# EasyEDA Pro project ProDoc_ChisFlash-MBC5-v1.21_8M.epro

# Schematic ChisFlash-MBC5-v1.21
Board Name: ChisFlash-MBC5-v1.2; Create Date: 2024-10-09; Page Name: P1; Project Name: ChisFlash-MBC5（GBC烧录卡）; Schematic Name: ChisFlash-MBC5-v1.2; Update Date: 2024-11-28; Company: 嘉立创EDA; Page Size: A4; Version: V1.0
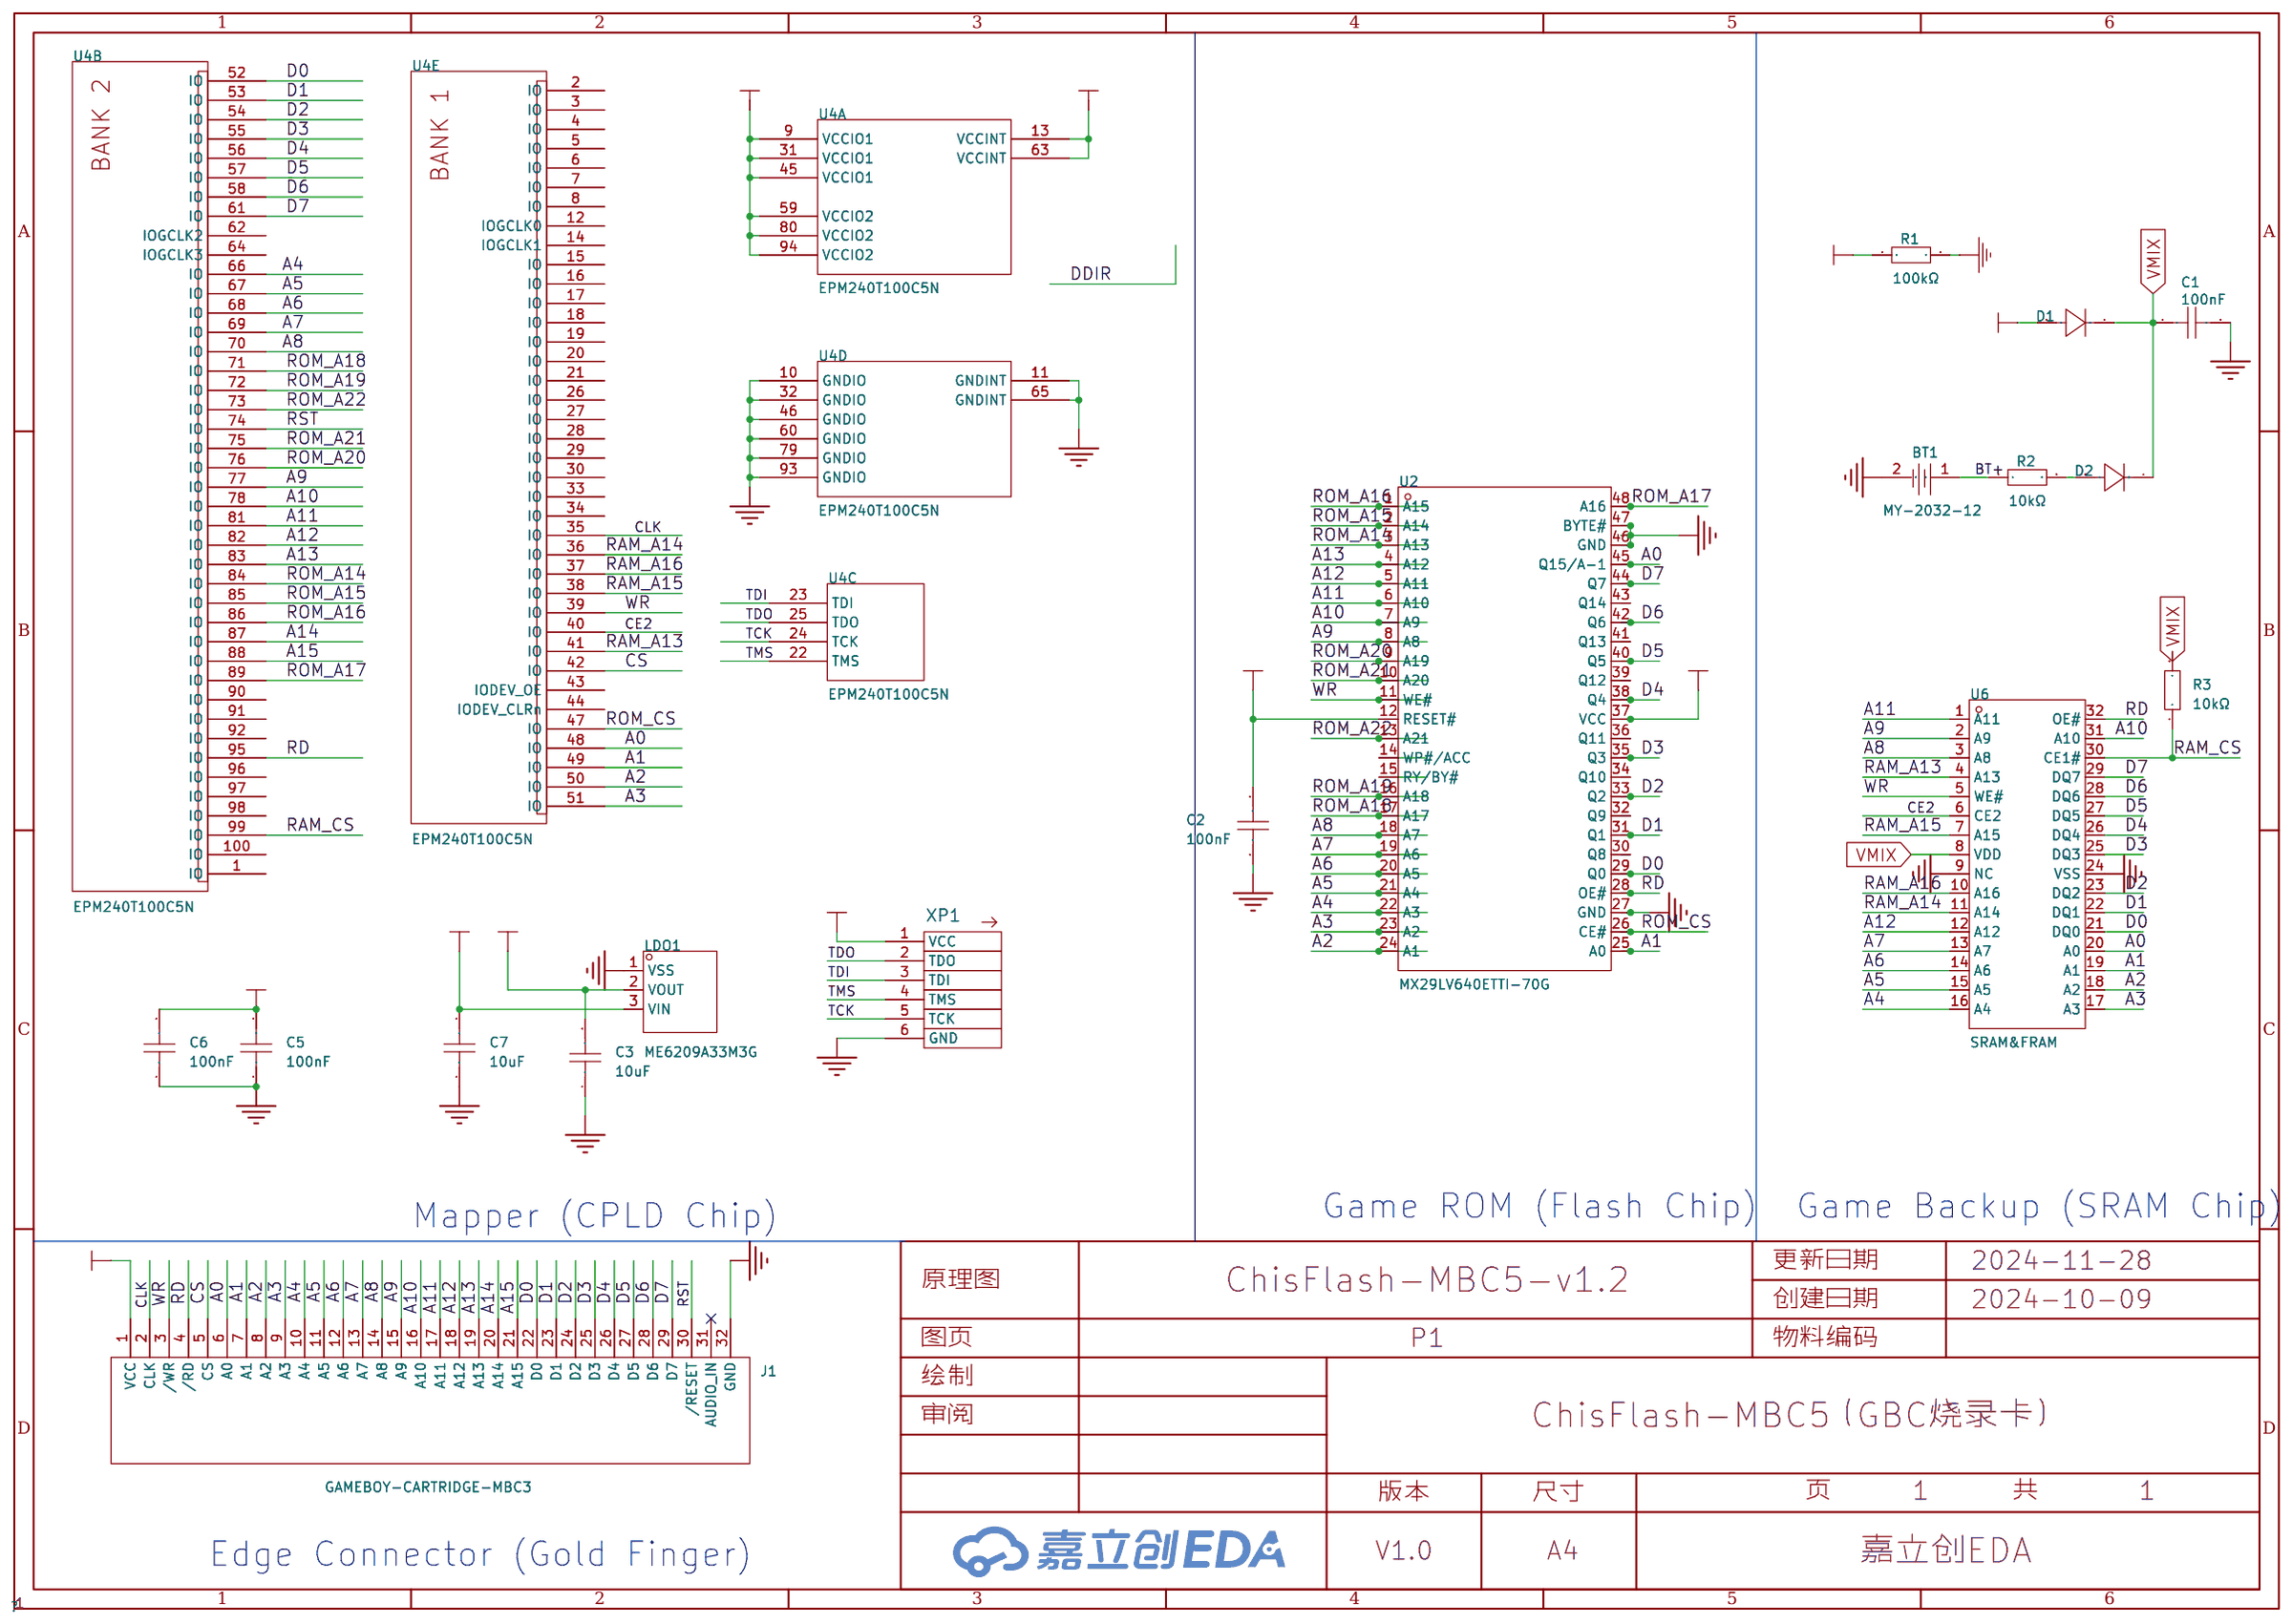
[diagram p0: schematic sheet]

## Parts
BT1  MY-2032-12  [BAT-SMD_MY-2032-12]
C1  100nF  [C0603]
C2  100nF  [C0603]
C3  10uF  [C0603]
C5  100nF  [C0603]
C6  100nF  [C0603]
C7  10uF  [C0603]
D1  1N4148WS  [SOD-323_L1.8-W1.3-LS2.5-RD]
D2  1N4148WS  [SOD-323_L1.8-W1.3-LS2.5-RD]
J1  GAMEBOY-CARTRIDGE-MBC3  [GAMEBOY_CARTRIDGE_PIN]
LDO1  ME6209A33M3G  [SOT-23-3_L2.9-W1.6-P1.90-LS2.8-BR]
R1  100kΩ  [R0603]
R2  10kΩ  [R0603]
R3  10kΩ  [R0603]
U2  MX29LV640ETTI-70G  [TSOP-48_L12.0-W18.4-P0.50-LS20.0-BL]
U4  EPM240T100C5N  [TQFP-100_L14.0-W14.0-P0.50-LS16.0-BL]  (sections 1,2,3,4,5)
U6  SRAM&FRAM  [TSSOP-TSOP二合一]
XP1  JTAG  [HDR-TH_6P-P1.27-V-M-1]  (no BOM)

## Library data of the parts
BT1 = MY-2032-12: LCSC Part Name: CR2032 电池扣; Supplier Part: C964833; Manufacturer: MYOUNG(美阳); Supplier Footprint: SMT; JLCPCB Part Class: Extended Part; Datasheet: https://atta.szlcsc.com/upload/public/pdf/source/20201218/C964833_8D2DD5FC6B310B5B4EFEF4B683694189.pdf; Supplier: LCSC
C1 C2 C5 C6 = CGA0603X7R104K500JT: 容值:100nF;精度:±10%;额定电压:50V;材质(温度系数):X7R;; LCSC Part Name: 100nF ±10% 50V; Supplier Part: C6119867; Manufacturer: HRE(芯声); Supplier Footprint: 0603; JLCPCB Part Class: Extended Part; Supplier: LCSC; Tolerance: ±10%; Voltage Rated: 50V; Temperature Coefficient: X7R
C3 C7 = CL10A106MA8NRNC: 容值:10uF;精度:±20%;额定电压:25V;材质(温度系数):X5R;; LCSC Part Name: 10uF ±20% 25V; Supplier Part: C96446; Manufacturer: SAMSUNG(三星); Supplier Footprint: 0603; JLCPCB Part Class: 基础库; Datasheet: https://atta.szlcsc.com/upload/public/pdf/source/20160218/1457707763339.pdf; Supplier: LCSC; Tolerance: ±20%; Voltage Rated: 25V; Temperature Coefficient: X5R
D1 D2 = 1N4148WS_C917117: 二极管配置:独立式;正向压降(Vf):1.25V@150mA;直流反向耐压(Vr):100V;平均整流电流(Io):300mA;功率:400mW;反向恢复时间(trr):8ns;; LCSC Part Name: 电压:100V 电流:300mA; Supplier Part: C917117; Manufacturer: JSMSEMI(杰盛微); Supplier Footprint: SOD-323; JLCPCB Part Class: Extended Part; Datasheet: https://atta.szlcsc.com/upload/public/pdf/source/20230807/08D9F448A82EA88A23B325A669586A09.pdf; Supplier: LCSC; Diode Configuration: 独立式; Forward Voltage (Vf@If): 1.25V@150mA; Reverse Voltage (Vr): 100V; Average Rectified Current (Io): 300mA; Power Dissipation: 400mW; Reverse Leakage Current: 1uA@75V; Reverse Recovery Time (trr): 8ns; Operating Temperature: -55℃~+150℃@(Tj)
J1 = GAMEBOY-CARTRIDGE-MBC3
LDO1 = ME6209A33M3G: 输出类型:固定;最大输入电压:18V;输出电压:3.3V;最大输出电流:250mA;电源纹波抑制比(PSRR):-;输出极性:正极;; LCSC Part Name: 输入18V 输出3.3V 250mA; Supplier Part: C83508; Manufacturer: MICRONE(南京微盟); Supplier Footprint: SOT-23-3L; JLCPCB Part Class: 扩展库; Datasheet: https://atta.szlcsc.com/upload/public/pdf/source/20161212/1481539101152.pdf; Supplier: LCSC; Output Type: 固定; Maximum Input Voltage: 18V; Output Voltage: 3.3V; MAX Output Current: 250mA; Dropout Voltage: 80mV@(40mA); Output Polarity: 正极; Number of Outputs: 1
R1 = 0603WAF1003T5E: 电阻类型:厚膜电阻;阻值:100kΩ;精度:±1%;功率:100mW;最大工作电压:75V;温度系数:±100ppm/℃;; LCSC Part Name: 100kΩ ±1% 100mW 厚膜电阻; Supplier Part: C25803; Manufacturer: UNI-ROYAL(厚声); Supplier Footprint: 0603; JLCPCB Part Class: Basic Part; Datasheet: https://atta.szlcsc.com/upload/public/pdf/source/20200306/C422600_1E6D84923E4A46A82E41ADD87F860B5C.pdf; Supplier: LCSC; Type: 厚膜电阻; Tolerance: ±1%; Power(Watts): 100mW; Overload Voltage (Max): 75V; Temperature Coefficient: ±100ppm/℃; Operating Temperature Range: -55℃~+155℃; Resistance: 47K
R2 R3 = 0603WAF1002T5E: 电阻类型:厚膜电阻;阻值:10kΩ;精度:±1%;功率:100mW;温度系数:±100ppm/℃;最大工作电压:75V;工作温度范围:-55℃~+155℃;; LCSC Part Name: 10kΩ ±1% 100mW; Supplier Part: C25804; Manufacturer: UNI-ROYAL(厚声); Supplier Footprint: 0603; JLCPCB Part Class: Basic Part; Datasheet: https://atta.szlcsc.com/upload/public/pdf/source/20200306/C422600_1E6D84923E4A46A82E41ADD87F860B5C.pdf; Supplier: LCSC; Type: 厚膜电阻; Tolerance: ±1%; Power(Watts): 100mW; Temperature Coefficient: ±100ppm/℃; Overload Voltage (Max): 75V; Operating Temperature Range: -55℃~+155℃; Resistance: 47K
U2 = MX29LV640ETTI-70G: Supplier Part: C504703; Manufacturer: MXIC(旺宏电子); Supplier Footprint: TSOP-48-18.4mm; JLCPCB Part Class: 扩展库; Datasheet: https://atta.szlcsc.com/upload/public/pdf/source/20140417/1457707044232.pdf; Supplier: LCSC
U4 = EPM240T100C5N: 类型:其它PLD;逻辑门数量:-;逻辑单元数:-;逻辑阵列块数:240;; Supplier Part: C10041; Manufacturer: Intel/Altera; Supplier Footprint: TQFP-100(14x14); JLCPCB Part Class: 扩展库; Datasheet: https://atta.szlcsc.com/upload/public/pdf/source/20121123/1457706563537.pdf; Supplier: LCSC; Type: 其它PLD; Supply Voltage Range - VCCIO: 3.3V；2.5V; Logic Array Blocks: 240; Maximum Delay Time Tpd: 4.7ns; Operating Temperature Range: 0℃~+85℃
U6 = SRAM&FRAM
XP1 = jtag

## Nets
+3V3: C2.2 C3.2 C5.2 C6.2 D1.2(A) LDO1.2(VOUT) R1.1 U2.12(RESET#) U2.37(VCC) U4.9(VCCIO1) U4.13(VCCINT) U4.31(VCCIO1) U4.45(VCCIO1) U4.59(VCCIO2) U4.63(VCCINT) U4.80(VCCIO2) U4.94(VCCIO2) XP1.1(VCC)
+5V: C7.2 J1.1(VCC) LDO1.3(VIN)
GND: BT1.2 C1.2 C2.1 C3.1 C5.1 C6.1 C7.1 J1.32(GND) LDO1.1(VSS) R1.2 U2.27(GND) U2.46(GND) U2.47(BYTE#) U4.10(GNDIO) U4.11(GNDINT) U4.32(GNDIO) U4.46(GNDIO) U4.60(GNDIO) U4.65(GNDINT) U4.79(GNDIO) U4.93(GNDIO) U6.9(NC) U6.24(VSS) XP1.6(GND)
A0: J1.6(A0) U2.45(Q15/A-1) U4.48(IO) U6.20(A0)
A1: J1.7(A1) U2.25(A0) U4.49(IO) U6.19(A1)
A2: J1.8(A2) U2.24(A1) U4.50(IO) U6.18(A2)
A3: J1.9(A3) U2.23(A2) U4.51(IO) U6.17(A3)
A4: J1.10(A4) U2.22(A3) U4.66(IO) U6.16(A4)
A5: J1.11(A5) U2.21(A4) U4.67(IO) U6.15(A5)
A6: J1.12(A6) U2.20(A5) U4.68(IO) U6.14(A6)
A7: J1.13(A7) U2.19(A6) U4.69(IO) U6.13(A7)
A8: J1.14(A8) U2.18(A7) U4.70(IO) U6.3(A8)
A9: J1.15(A9) U2.8(A8) U4.77(IO) U6.2(A9)
A10: J1.16(A10) U2.7(A9) U4.78(IO) U6.31(A10)
A11: J1.17(A11) U2.6(A10) U4.81(IO) U6.1(A11)
A12: J1.18(A12) U2.5(A11) U4.82(IO) U6.12(A12)
A13: J1.19(A13) U2.4(A12) U4.83(IO)
A14: J1.20(A14) U4.87(IO)
A15: J1.21(A15) U4.88(IO)
BT+: BT1.1 R2.1
CE2: U4.40(IO) U6.6(CE2)
CLK: J1.2(CLK) U4.35(IO)
CS: J1.5(CS) U4.42(IO)
D0: J1.22(D0) U2.29(Q0) U4.52(IO) U6.21(DQ0)
D1: J1.23(D1) U2.31(Q1) U4.53(IO) U6.22(DQ1)
D2: J1.24(D2) U2.33(Q2) U4.54(IO) U6.23(DQ2)
D3: J1.25(D3) U2.35(Q3) U4.55(IO) U6.25(DQ3)
D4: J1.26(D4) U2.38(Q4) U4.56(IO) U6.26(DQ4)
D5: J1.27(D5) U2.40(Q5) U4.57(IO) U6.27(DQ5)
D6: J1.28(D6) U2.42(Q6) U4.58(IO) U6.28(DQ6)
D7: J1.29(D7) U2.44(Q7) U4.61(IO) U6.29(DQ7)
RAM_A13: U4.41(IO) U6.4(A13)
RAM_A14: U4.36(IO) U6.11(A14)
RAM_A15: U4.38(IO) U6.7(A15)
RAM_A16: U4.37(IO) U6.10(A16)
RAM_CS: R3.1 U4.99(IO) U6.30(CE1#)
RD: J1.4(/RD) U2.28(OE#) U4.95(IO) U6.32(OE#)
ROM_A14: U2.3(A13) U4.84(IO)
ROM_A15: U2.2(A14) U4.85(IO)
ROM_A16: U2.1(A15) U4.86(IO)
ROM_A17: U2.48(A16) U4.89(IO)
ROM_A18: U2.17(A17) U4.71(IO)
ROM_A19: U2.16(A18) U4.72(IO)
ROM_A20: U2.9(A19) U4.76(IO)
ROM_A21: U2.10(A20) U4.75(IO)
ROM_A22: U2.13(A21) U4.73(IO)
ROM_CS: U2.26(CE#) U4.47(IO)
RST: J1.30(/RESET) U4.74(IO)
TCK: U4.24(TCK) XP1.5(TCK)
TDI: U4.23(TDI) XP1.3(TDI)
TDO: U4.25(TDO) XP1.2(TDO)
TMS: U4.22(TMS) XP1.4(TMS)
VMIX: C1.1 D1.1(C) D2.1(C) R3.2 U6.8(VDD)
WR: J1.3(/WR) U2.11(WE#) U4.39(IO) U6.5(WE#)
$1N4617: D2.2(A) R2.2

Not connected (* = marked no-connect by the designer): J1 31(AUDIO_IN)*; U2 14(WP#/ACC) 15(RY/BY#) 30(Q8) 32(Q9) 34(Q10) 36(Q11) 39(Q12) 41(Q13) 43(Q14); U4 1(IO) 2(IO) 3(IO) 4(IO) 5(IO) 6(IO) 7(IO) 8(IO) 12(IOGCLK0) 14(IOGCLK1) 15(IO) 16(IO) 17(IO) 18(IO) 19(IO) 20(IO) 21(IO) 26(IO) 27(IO) 28(IO) 29(IO) 30(IO) 33(IO) 34(IO) 43(IODEV_OE) 44(IODEV_CLRn) 62(IOGCLK2) 64(IOGCLK3) 90(IO) 91(IO) 92(IO) 96(IO) 97(IO) 98(IO) 100(IO)

## Notes on the sheet
- Mapper (CPLD Chip)
- Game ROM (Flash Chip)
- Game Backup (SRAM Chip)
- Edge Connector (Gold Finger)

# Board ChisFlash-MBC5-v1.21
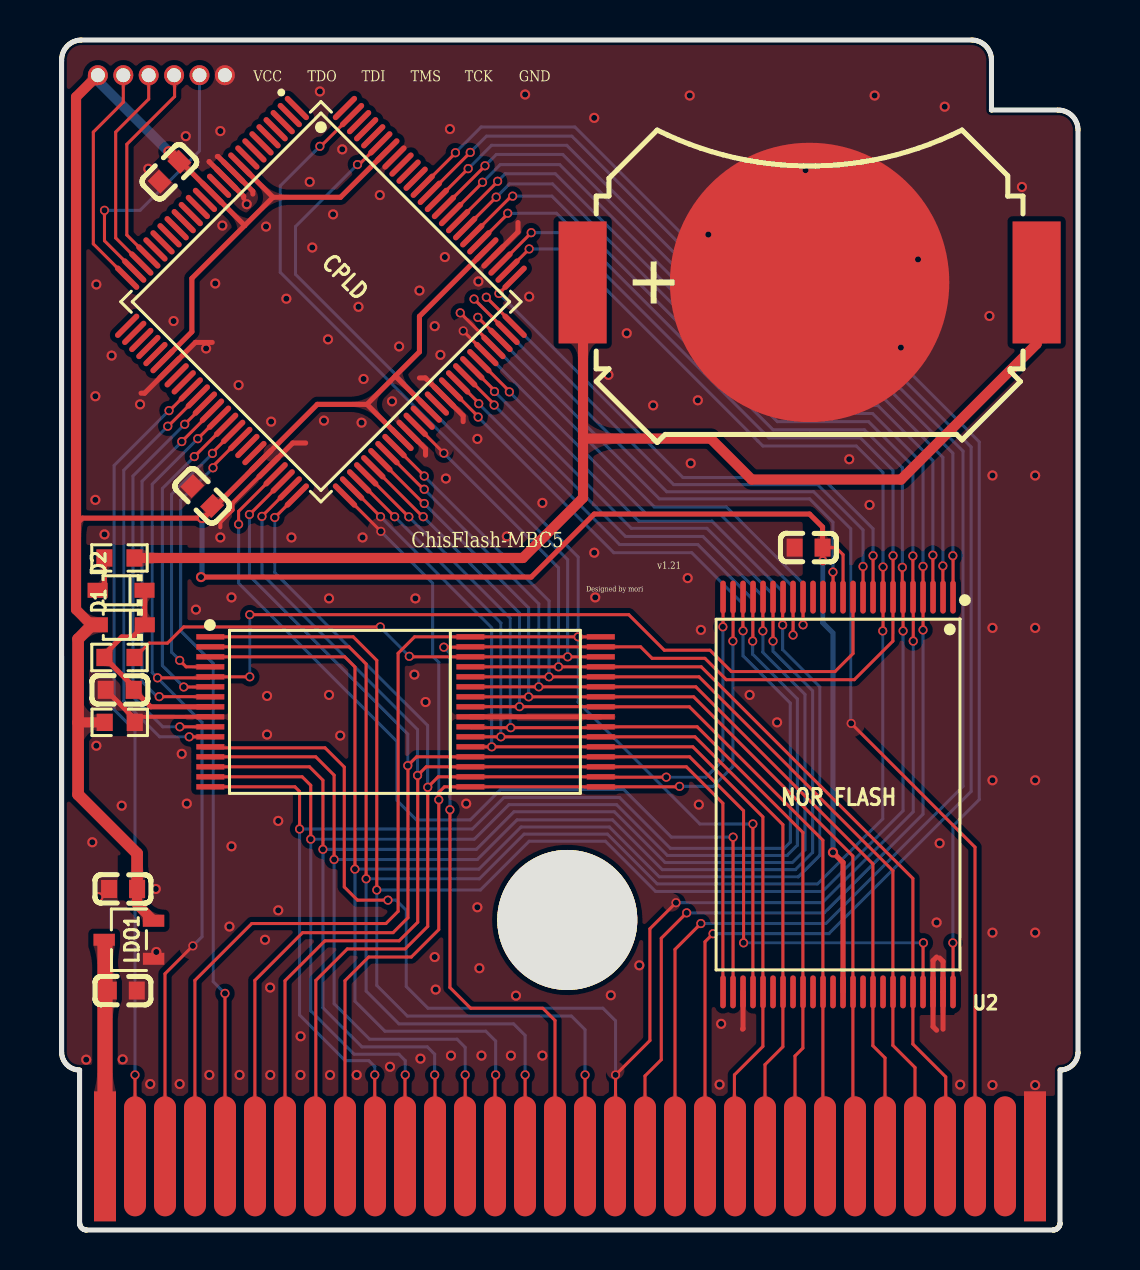
[diagram p1: board, top side]
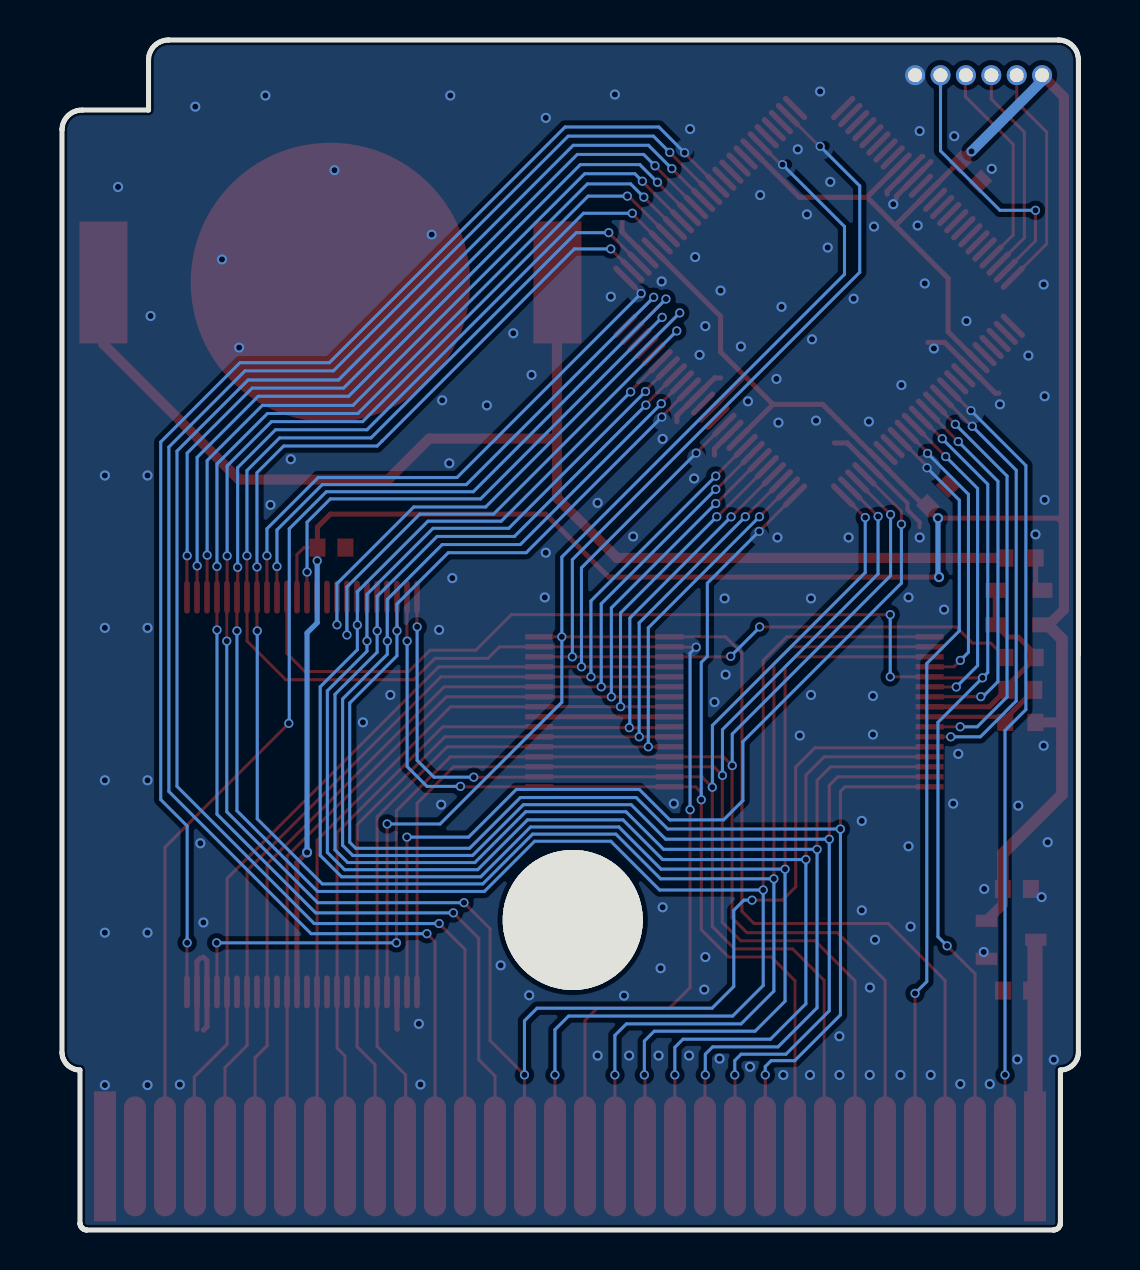
[diagram p2: board, bottom side, seen from below]

Outline 50.82 x 59.5 mm; copper layers: Top Layer, Bottom Layer. Coordinates in mm from the lower left corner of the outline.
Stack: Top Layer 0.035mm / Dielectric1 1.51mm FR4 er 4.5 / Bottom Layer 0.035mm

## Design rules (mm)
template: 自定义配置
spacing copperThickness1oz (default): track to track 0.102, other pairs 0.152 to 0.152
spacing copperThickness2oz: track to track 0.203, other pairs 0.152 to 0.3
track width copperThickness1oz (default): min 0.152, default 0.152, max 2.54
track width copperThickness2oz: min 0.203, default 0.254, max 2.54
differential pair differentialPair (default): width min 0.127, default 0.254, max 2.54; gap min 0.152, default 0.152
via viaSize (default): diameter min 0.406, default 0.457, max 10; hole min 0.3, default 0.305, max 6.299

## Placement (name value [footprint] x y rotation side)
BT1  MY-2032-12  [BAT-SMD_MY-2032-12]  37.4 47.38 180 top
C1  100nF  [C0603]  2.91 27.01 180 top
C2  100nF  [C0603]  37.35 34.12 0 top
C3  10uF  [C0603]  3.07 17.05 0 top
C5  100nF  [C0603]  7.03 36.7 315 top
C6  100nF  [C0603]  5.4 52.92 45 top
C7  10uF  [C0603]  3.06 11.97 180 top
D1  1N4148WS  [SOD-323_L1.8-W1.3-LS2.5-RD]  2.99 30.26 180 top
D2  1N4148WS  [SOD-323_L1.8-W1.3-LS2.5-RD]  2.97 31.99 180 top
J1  GAMEBOY-CARTRIDGE-MBC3  [GAMEBOY_CARTRIDGE_PIN]  25.28 15.5 0 top
LDO1  ME6209A33M3G  [SOT-23-3_L2.9-W1.6-P1.90-LS2.8-BR]  3.36 14.51 0 top
R1  100kΩ  [R0603]  2.91 25.38 0 top
R2  10kΩ  [R0603]  2.89 33.6 180 top
R3  10kΩ  [R0603]  2.89 28.63 180 top
U2  MX29LV640ETTI-70G  [TSOP-48_L12.0-W18.4-P0.50-LS20.0-BL]  38.82 21.78 180 top
U4  EPM240T100C5N  [TQFP-100_L14.0-W14.0-P0.50-LS16.0-BL]  12.96 46.42 225 top
U6  SRAM&FRAM  [TSSOP-TSOP二合一]  18.2 25.89 180 top
XP1  JTAG  [HDR-TH_6P-P1.27-V-M-1]  4.99 57.74 0 top

## Footprints (pads in the part's own frame, mm; a bottom-side part is the same pattern mirrored in y, then rotated)
BAT-SMD_MY-2032-12
  rect 2.4x6.1 smd: 1(-11.35,0) 1(11.35,0)
  round 13.97 smd: 2(0,0)
C0603
  rect 0.8x0.9 smd: 1(-0.7,0) 2(0.7,0)
GAMEBOY_CARTRIDGE_PIN
  round 7 hole 7: 0(0,0)
  rect 1.1x6.5 smd: 1(-23.114,-11.819) 32(23.386,-11.819)
  oval 1.1x6 smd: 2(-21.614,-11.819) 3(-20.114,-11.819) 4(-18.614,-11.819) 5(-17.114,-11.819) 6(-15.614,-11.819) 7(-14.114,-11.819) 8(-12.614,-11.819) 9(-11.114,-11.819) 10(-9.614,-11.819) 11(-8.114,-11.819) 12(-6.614,-11.819) 13(-5.114,-11.819) 14(-3.614,-11.819) 15(-2.114,-11.819) 16(-0.614,-11.819) 17(0.886,-11.819) 18(2.386,-11.819) 19(3.886,-11.819) 20(5.386,-11.819) 21(6.886,-11.819) 22(8.386,-11.819) 23(9.886,-11.819) 24(11.386,-11.819) 25(12.886,-11.819) 26(14.386,-11.819) 27(15.886,-11.819) 28(17.386,-11.819) 29(18.886,-11.819) 30(20.386,-11.819) 31(21.886,-11.819)
HDR-TH_6P-P1.27-V-M-1
  round 1 hole 0.7: 1(-3.175,0) 2(-1.905,0) 3(-0.635,0) 4(0.635,0) 5(1.905,0) 6(3.175,0)
R0603
  rect 0.806x0.864 smd: 1(-0.753,0) 2(0.753,0)
SOD-323_L1.8-W1.3-LS2.5-RD
  rect 1x0.75 smd: 1(-1.173,0) 2(1.173,0)
SOT-23-3_L2.9-W1.6-P1.90-LS2.8-BR
  rect 1.07x0.6 smd: 1(1.235,-0.95) 2(1.235,0.95) 3(-1.235,0)
TQFP-100_L14.0-W14.0-P0.50-LS16.0-BL
  oval 0.28x1.6 smd: 1(-6,-7.7) 2(-5.5,-7.7) 3(-5,-7.7) 4(-4.5,-7.7) 5(-4,-7.7) 6(-3.5,-7.7) 7(-3,-7.7) 8(-2.5,-7.7) 9(-2,-7.7) 10(-1.5,-7.7) 11(-1,-7.7) 12(-0.5,-7.7) 13(0,-7.7) 14(0.5,-7.7) 15(1,-7.7) 16(1.5,-7.7) 17(2,-7.7) 18(2.5,-7.7) 19(3,-7.7) 20(3.5,-7.7) 21(4,-7.7) 22(4.5,-7.7) 23(5,-7.7) 24(5.5,-7.7) 25(6,-7.7) 51(6,7.7) 52(5.5,7.7) 53(5,7.7) 54(4.5,7.7) 55(4,7.7) 56(3.5,7.7) 57(3,7.7) 58(2.5,7.7) 59(2,7.7) 60(1.5,7.7) 61(1,7.7) 62(0.5,7.7) 63(0,7.7) 64(-0.5,7.7) 65(-1,7.7) 66(-1.5,7.7) 67(-2,7.7) 68(-2.5,7.7) 69(-3,7.7) 70(-3.5,7.7) 71(-4,7.7) 72(-4.5,7.7) 73(-5,7.7) 74(-5.5,7.7) 75(-6,7.7)
  oval 1.6x0.28 smd: 26(7.7,-6) 27(7.7,-5.5) 28(7.7,-5) 29(7.7,-4.5) 30(7.7,-4) 31(7.7,-3.5) 32(7.7,-3) 33(7.7,-2.5) 34(7.7,-2) 35(7.7,-1.5) 36(7.7,-1) 37(7.7,-0.5) 38(7.7,0) 39(7.7,0.5) 40(7.7,1) 41(7.7,1.5) 42(7.7,2) 43(7.7,2.5) 44(7.7,3) 45(7.7,3.5) 46(7.7,4) 47(7.7,4.5) 48(7.7,5) 49(7.7,5.5) 50(7.7,6) 76(-7.7,6) 77(-7.7,5.5) 78(-7.7,5) 79(-7.7,4.5) 80(-7.7,4) 81(-7.7,3.5) 82(-7.7,3) 83(-7.7,2.5) 84(-7.7,2) 85(-7.7,1.5) 86(-7.7,1) 87(-7.7,0.5) 88(-7.7,0) 89(-7.7,-0.5) 90(-7.7,-1) 91(-7.7,-1.5) 92(-7.7,-2) 93(-7.7,-2.5) 94(-7.7,-3) 95(-7.7,-3.5) 96(-7.7,-4) 97(-7.7,-4.5) 98(-7.7,-5) 99(-7.7,-5.5) 100(-7.7,-6)
TSOP-48_L12.0-W18.4-P0.50-LS20.0-BL
  oval 0.28x1.65 smd: 1(-5.75,-9.87) 2(-5.25,-9.87) 3(-4.75,-9.87) 4(-4.25,-9.87) 5(-3.75,-9.87) 6(-3.25,-9.87) 7(-2.75,-9.87) 8(-2.25,-9.87) 9(-1.75,-9.87) 10(-1.25,-9.87) 11(-0.75,-9.87) 12(-0.25,-9.87) 13(0.25,-9.87) 14(0.75,-9.87) 15(1.25,-9.87) 16(1.75,-9.87) 17(2.25,-9.87) 18(2.75,-9.87) 19(3.25,-9.87) 20(3.75,-9.87) 21(4.25,-9.87) 22(4.75,-9.87) 23(5.25,-9.87) 24(5.75,-9.87) 25(5.75,9.87) 26(5.25,9.87) 27(4.75,9.87) 28(4.25,9.87) 29(3.75,9.87) 30(3.25,9.87) 31(2.75,9.87) 32(2.25,9.87) 33(1.75,9.87) 34(1.25,9.87) 35(0.75,9.87) 36(0.25,9.87) 37(-0.25,9.87) 38(-0.75,9.87) 39(-1.25,9.87) 40(-1.75,9.87) 41(-2.25,9.87) 42(-2.75,9.87) 43(-3.25,9.87) 44(-3.75,9.87) 45(-4.25,9.87) 46(-4.75,9.87) 47(-5.25,9.87) 48(-5.75,9.87)
TSSOP-TSOP二合一
  rect 1.399x0.27 smd: 1(10.762,-3.769) 2(10.762,-3.269) 3(10.762,-2.769) 4(10.762,-2.269) 5(10.762,-1.769) 6(10.762,-1.269) 7(10.762,-0.769) 8(10.762,-0.269) 9(10.762,0.231) 10(10.762,0.731) 11(10.762,1.231) 12(10.762,1.731) 13(10.762,2.231) 14(10.762,2.731) 15(10.762,3.231) 16(10.762,3.731) 17(-8.763,3.731) 17(-2.243,3.731) 18(-8.763,3.231) 18(-2.243,3.231) 19(-8.763,2.731) 19(-2.243,2.731) 20(-8.763,2.231) 20(-2.243,2.231) 21(-8.763,1.731) 21(-2.243,1.731) 22(-8.763,1.231) 22(-2.243,1.231) 23(-8.763,0.731) 23(-2.243,0.731) 24(-8.763,0.231) 24(-2.243,0.231) 25(-8.763,-0.269) 25(-2.243,-0.269) 26(-8.763,-0.769) 26(-2.243,-0.769) 27(-8.763,-1.269) 27(-2.243,-1.269) 28(-8.763,-1.769) 28(-2.243,-1.769) 29(-8.763,-2.269) 29(-2.243,-2.269) 30(-8.763,-2.769) 30(-2.243,-2.769) 31(-8.763,-3.269) 31(-2.243,-3.269) 32(-8.763,-3.769) 32(-2.243,-3.769)

## Nets
As in the schematic.

Pads without a net: J1 0 31; U4 1 2 3 4 5 6 7 8 12 14 15 16 17 18 19 20 21 26 27 28 29 30 33 34 43 44 62 64 90 91 92 96 97 98 100

## Via types
v1: diameter 0.508, hole 0.305, Top Layer to Bottom Layer, 137 vias
v2: diameter 0.457, hole 0.305, Top Layer to Bottom Layer, 129 vias

## Routing (per net, layer and track width the routed paths; a pad name or vN(x,y) marks a point on that pad's centre or on a via; arc(x,y) is an arc through that point)
+3V3: length 171.4
  Top Layer w0.152: U2.12 39.07,33.77 38.72,34.12 C2.2
  Top Layer w0.254: U4.63 16.68,42.7 ; 16.68,42.7 15.27,41.28 ; 16.68,42.7 17.89,43.91 17.89,45.69 21.24,49.03 ; C6.2 5.97,53.41 U4.13 9.15,50.23 ; 15.27,41.28 U4.59 ; 15.27,41.28 12.78,41.28 U4.45 7.09,35.59 v1(7.02,35.59) 1.04,35.59 0.72,35.28 ; U4.31 6.51,44.91 6.51,47.58 9.15,50.23 ; 9.15,50.23 10.57,51.64 ; 10.57,51.64 U4.9 ; 10.57,51.64 13.95,51.64 U4.94 ; v2(38.06,33.46) 38.06,34.11 C2.2 38.05,35.15 37.4,35.8 26.63,35.8 23.48,32.65 v1(6.97,32.65) ; U2.37 39.07,18.38 v1(38.57,18.88)
  Top Layer w0.508: v2(5.34,53.93) 5.37,53.93 C6.2 ; R1.1 0.84,25.38 0.82,25.37 ; 1.54,30.26 1.48,30.26 0.72,31.02 0.72,56.65 XP1.1 ; LDO1.2 3.77,16.29 C3.2
  Top Layer w0.584: 1.81,30.26 1.54,30.26 0.82,29.55 0.82,21.78 3.77,18.83 C3.2
  Bottom Layer w0.254: v1(6.97,32.65) 7.02,32.7 v1(7.02,35.59) ; v1(38.57,18.88) 38.57,29.85 38.06,30.36 v2(38.06,33.46)
  Bottom Layer w0.508: XP1.1 1.81,57.46 v2(5.34,53.93)
+5V: length 10.7
  Top Layer w0.762: 2.16,14.34 2.17,14.32 J1.1
GND: length 45.1
  Top Layer w0.203: U4.46 8.55,36.34 8.55,36 7.94,35.39 7.94,35.14 ; R1.2 3.94,25.66 U6.9
  Top Layer w0.254: 17.89,42.61 18.19,42.61 U4.65 20.08,40.72 20.08,40.42 ; 43.75,9.99 43.57,10.17 U2.46 43.57,13.47 43.75,13.65 ; U4.79 22.82,49.91 22.82,50.38 ; 12.2,39.35 11.56,39.35 U4.46 ; 9.1,51.6 9.1,51.69 U4.11 7.38,53.42 7.38,53.43 ; C1.2 3.66,25.56 R1.2 ; 7.78,53.68 7.82,53.68 U4.10 9.56,51.94 9.56,51.8 ; 3.97,41.84 4.15,41.84 U4.32 6.69,44.38 7.53,44.38 ; 18.2,38.74 18.2,39.06 U4.60 ; 34.05,10.04 34.07,10.07 U2.27 ; 44.07,10.04 U2.47 44.07,13.43 43.9,13.6 ; U6.24 U6.24
  vias: v1(1.23,8.52) v1(1.53,19.39) v1(1.69,41.69) v1(1.69,36.51) v1(1.74,47.28) v1(1.74,24.22) v1(1.84,16.65) v1(2.14,34.78) v1(2.5,43.72) v1(3,21.22) v1(3.05,8.53) v1(3.92,41.28) v1(4.33,53.06) v1(4.43,7.3) v1(4.71,17.05) v1(4.74,13.9) v1(5.6,45.45) v1(5.9,7.3) v1(6.01,23.81) v1(6.21,54.7) v1(6.26,21.32) v1(6.72,31.02) v1(7.22,44.08) v1(7.39,7.75) v1(7.68,47.33) v1(7.94,54.95) v1(7.94,34.63) v1(8.04,50.23) v1(8.39,15.17) v1(8.49,31.63) v1(8.49,19.19) v1(8.85,42.25) v1(8.9,7.75) v1(9.26,51.29) v1(10.17,14.51) v1(10.22,50.17) v1(10.27,26.7) v1(10.27,24.77) v1(10.48,40.42) v1(10.42,12.13) v1(10.43,7.75) v1(10.83,20.46) v1(10.83,15.99) v1(11.24,46.57) v1(11.49,34.63) v1(11.95,9.69) v1(11.94,7.75) v1(12.41,52.41) v1(12.53,49.13) v1(12.91,56.93) v1(13.12,40.47) v1(13.32,44.54) v1(13.37,31.58) v1(13.37,26.76) v1(13.42,7.75) v1(13.57,50.78) v1(13.93,24.72) v1(14.03,54.04) v1(14.75,7.75) v1(14.84,46.16) v1(15,40.37) v1(15.1,42.55) v1(15.05,34.63) v1(15.91,51.75) v1(16.42,8.16) v1(16.52,41.44) v1(16.88,44.18) v1(17.69,31.58) v1(17.64,27.77) v1(17.89,46.97) v1(17.94,8.57) v1(18.2,26.4) v1(18.66,45.2) v1(18.65,13.65) v1(18.71,12.02) v1(18.94,43.76) v1(19.16,48.65) v1(19.21,37.58) v1(19.42,55.05) v1(19.47,8.72) v1(20.23,21.32) v1(20.79,39.56) v1(20.79,16.14) v1(20.84,47.43) v1(20.89,13.09) v1(20.99,8.72) v1(22.26,34.68) v1(22.46,8.72) v1(22.72,11.72) v1(23.18,56.78) v1(23.38,46.67) v1(24.04,36.36) v1(24.04,8.72) v1(26.63,55.61) v1(26.63,33.87) v1(26.68,31.63) v1(27.34,42.76) v1(27.46,11.74) v1(28.26,44.84) v1(28.89,13.23) v1(29.58,41.23) v1(31.3,32.6) v1(31.41,56.73) v1(31.46,38.34) v1(31.81,41.49) v1(31.86,21.27) v1(31.96,30.01) v1(32.34,49.77) v1(32.9,7.27) v1(32.98,10.31) v1(34.4,26.76) v1(35.77,25.38) v1(37.2,52.99) v1(39.38,38.54) v1(40.4,36.26) v1(40.65,56.73) v1(41.96,44.12) v1(42.82,48.53) v1(43.75,15.38) v1(43.9,19.34) v1(44.16,56.17) v1(44.93,7.27) v1(46.39,45.7) v1(46.54,37.73) v1(46.54,30.11) v1(46.54,22.49) v1(46.54,14.87) v1(46.54,7.25) v1(48.02,52.16) v1(48.68,37.73) v1(48.68,30.11) v1(48.68,22.49) v1(48.68,14.87) v1(48.68,7.25)
A0: length 79.7
  Top Layer w0.152: 11.06,37.43 9.4,35.78 v2(9.39,35.78) ; J1.6 9.66,3.69 9.66,12.48 12.05,14.87 16.57,14.87 17.32,15.61 17.32,23.21 v2(17.31,23.22) 17.75,23.66 U6.20 U6.20 31.4,23.66 34.1,20.96 v2(34.1,14.36) ; v2(43.09,14.36) 43.07,14.34 U2.45
  Bottom Layer w0.152: v2(17.31,23.22) 17.31,24.8 9.39,32.72 v2(9.39,35.78) ; v2(34.1,14.36) v2(43.09,14.36)
A1: length 67.8
  Top Layer w0.152: v2(10.02,35.68) 10.02,35.69 U4.49 ; U2.25 33.06,11.92 33.06,21.34 31.24,23.16 U6.19 U6.19 18.23,23.16 v2(17.8,22.73) 17.81,22.72 17.81,15.39 16.88,14.46 13.17,14.46 11.17,12.46 J1.7
  Bottom Layer w0.152: v2(17.8,22.73) 17.8,25.02 10.02,32.8 v2(10.02,35.68)
A2: length 64.3
  Top Layer w0.152: v2(33.06,30.16) 33.07,30.17 U2.24 ; v2(30.23,22.64) 26.98,22.64 U6.18 U6.18 18.83,22.66 v2(18.31,22.14) 18.31,15.18 17.18,14.06 14.29,14.06 12.71,12.48 12.71,3.73 J1.8 ; U4.50 10.66,35.63 v2(10.66,35.63)
  Bottom Layer w0.152: 18.3,22.07 18.3,25.23 10.66,32.87 v2(10.66,35.63) ; v2(30.23,22.64) 32.22,22.64 33.06,23.49 v2(33.06,30.16)
A3: length 62.3
  Top Layer w0.152: U2.23 33.57,29.46 v2(33.56,29.45) ; v2(30.9,22.18) 30.87,22.16 U6.17 U6.17 19.14,22.16 18.86,21.88 v2(18.86,21.51) 18.86,15.02 17.49,13.65 15.35,13.65 14.17,12.47 J1.9 ; v2(15.96,34.93) 14.17,36.73
  Bottom Layer w0.152: v2(15.96,34.93) 18.55,32.34 18.55,28.69 18.86,28.38 v2(18.86,21.51) ; v2(30.9,22.18) 32.57,22.18 33.56,23.17 v2(33.56,29.45)
A4: length 85.1
  Top Layer w0.152: v2(11.9,20.05) 11.9,21.93 11.67,22.16 U6.16 ; 34.06,31.68 34.06,29.97 v2(34.07,29.96) ; J1.10 15.66,3.7 v2(15.66,7.76) ; v2(20.83,40.65) 20.83,40.67 U4.66
  Bottom Layer w0.152: v2(20.83,40.65) 27.61,33.87 31.51,33.87 34.07,31.3 v2(34.07,29.96) 34.07,28.71 36.43,26.35 36.43,19.39 36.13,19.08 30.44,19.08 27.9,21.62 22.11,21.62 20.53,20.05 v2(11.9,20.05) 11.9,10.75 14.18,8.47 15.36,8.47 15.66,8.17 v2(15.66,7.76)
A5: length 88
  Top Layer w0.152: 19.82,42.38 20.86,41.35 v2(20.86,41.32) ; v2(17.18,7.76) 17.17,7.74 J1.11 ; v2(12.46,19.54) 12.46,22.23 12.03,22.66 U6.15 ; v2(34.55,29.45) 34.56,29.46 34.56,31.68
  Bottom Layer w0.152: v2(20.86,41.32) 27.9,34.27 31.81,34.27 34.55,31.53 v2(34.55,29.45) 34.55,28.79 36.79,26.55 36.79,19.24 36.28,18.73 30.29,18.73 27.75,21.27 22.36,21.27 20.64,19.54 v2(12.46,19.54) 12.46,10.96 14.62,8.79 16.86,8.79 17.18,8.47 v2(17.18,7.76)
A6: length 89.9
  Top Layer w0.152: J1.12 18.67,7.74 v2(18.65,7.76) ; v2(13.07,19.03) 13.07,22.49 12.39,23.16 U6.14 ; v2(21.62,41.25) 21.62,41.29 U4.68 ; v2(35.06,29.96) 35.06,31.68
  Bottom Layer w0.152: v2(21.62,41.25) 28.19,34.68 32.07,34.68 35.06,31.68 v2(35.06,29.96) 35.06,28.89 37.17,26.78 37.17,19.01 36.54,18.37 30.18,18.37 27.64,20.91 22.62,20.91 20.74,19.03 v2(13.07,19.03) 13.07,11.11 15.02,9.16 18.29,9.16 18.65,8.79 v2(18.65,7.76)
A7: length 92.8
  Top Layer w0.152: U4.69 21.64,41.98 v2(21.64,41.93) ; J1.13 20.18,3.69 v2(20.18,7.76) ; 35.56,31.68 35.57,31.67 v2(35.57,29.45) ; v2(13.63,18.53) 13.63,22.74 12.71,23.66 U6.13
  Bottom Layer w0.152: v2(20.18,7.76) 20.18,9.13 19.77,9.54 15.4,9.54 13.63,11.31 v2(13.63,18.53) 20.79,18.53 22.77,20.51 27.54,20.51 30.03,18.02 36.69,18.02 37.55,18.88 37.55,26.96 35.57,28.94 v2(35.57,29.45) 35.57,31.78 32.27,35.09 28.48,35.09 v2(21.64,41.93)
A8: length 98.7
  Top Layer w0.152: J1.14 21.67,7.72 v2(21.7,7.76) ; v2(14.67,18.04) 14.67,28.15 14.16,28.66 U6.3 ; v2(22.39,41.91) 22.39,41.94 U4.70 ; v2(36.05,30.25) 36.05,31.66
  Bottom Layer w0.152: v2(21.7,7.76) 21.7,9.45 21.21,9.94 16.17,9.94 14.67,11.44 v2(14.67,18.04) 20.86,18.04 22.97,20.15 27.39,20.15 29.88,17.66 36.84,17.66 37.91,18.73 37.91,27.16 36.05,29.02 v2(36.05,30.25) 36.05,31.91 32.52,35.44 28.86,35.44 v2(22.39,41.91)
A9: length 109.7
  Top Layer w0.152: U6.2 14.37,29.16 15.23,28.3 v2(15.23,17.56) ; v2(23.18,7.76) 23.18,3.69 J1.15 ; v2(41.07,33.16) U2.8 41.07,29.96 ; v2(41.06,29.96) 41.06,29.96 ; U4.77 23.38,49.05 v2(23.38,49.06)
  Bottom Layer w0.152: v2(23.38,49.06) 25.2,49.06 34.81,39.46 34.81,39.46 35.06,39.2 39.74,39.2 41.07,37.87 v2(41.07,33.16) ; v2(41.06,29.96) 41.06,20.56 37.81,17.31 29.78,17.31 27.29,19.8 23.12,19.8 20.89,17.56 v2(15.23,17.56) 15.23,11.95 16.86,10.31 22.6,10.31 23.18,9.73 v2(23.18,7.76)
A10: length 87.6
  Top Layer w0.152: v2(19.11,29.14) 20.42,29.14 U6.31 U6.31 28.95,29.16 29.53,28.58 32.17,28.58 33.23,27.52 39.63,27.52 41.57,29.45 U2.7 ; U4.78 23.48,49.86 v2(23.48,49.87) ; J1.16 24.67,10.48 24.06,11.09 20.45,11.09 19.42,12.13 v2(19.42,21.02) ; 41.57,31.68 v2(41.57,33.72) ; 41.57,31.68 U2.7 ; 41.57,31.68 U2.7
  Bottom Layer w0.152: v2(23.48,49.87) 25.11,49.87 35.37,39.61 39.94,39.61 41.57,37.98 v2(41.57,33.72) ; v2(19.11,29.14) 19.42,28.84 v2(19.42,21.02)
A11: length 116.5
  Top Layer w0.152: 42.03,32.14 42.03,33.13 v2(42.04,33.14) ; U6.1 14.58,29.66 15.76,28.48 v2(15.76,17) ; v2(22.31,50.84) 22.31,50.81 20.88,49.39 ; v2(42.07,29.96) 42.07,31.67 42.06,31.68 ; J1.17 26.17,3.69 v2(26.17,7.76)
  Bottom Layer w0.152: v2(42.07,29.96) 42.07,20.96 38.04,16.93 29.7,16.93 27.19,19.44 23.38,19.44 20.94,17 v2(15.76,17) 15.76,12.23 17.29,10.7 25.49,10.7 26.17,10.02 v2(26.17,7.76) ; v2(22.31,50.84) 24.74,50.84 35.57,40.01 40.14,40.01 42.04,38.12 v2(42.04,33.14)
A12: length 108.2
  Top Layer w0.152: U4.82 22.49,51.7 v2(22.55,51.7) ; U2.5 42.58,31.64 v2(42.58,29.45) ; 7.03,24.11 13.17,24.11 14.13,23.15 14.13,17.15 14.79,16.49 v2(16.32,16.49) ; v2(30.72,16.37) 29.42,15.06 29.42,9.47 v2(27.7,7.76) 27.7,3.71 J1.18 ; v2(42.56,33.71) 42.56,31.68
  Bottom Layer w0.152: v2(42.56,33.71) 42.56,38.2 40.35,40.42 35.79,40.42 24.51,51.7 v2(22.55,51.7) ; v2(42.58,29.45) 42.58,20.91 38.03,16.37 v2(30.72,16.37) ; v2(27.7,7.76) 27.7,10.46 27.06,11.09 18.32,11.09 17.23,12.18 17.23,15.99 16.72,16.49 v2(16.32,16.49)
A13: length 74
  Top Layer w0.152: J1.19 29.17,7.71 29.98,8.52 29.98,14.59 v2(31.25,15.86) ; 43.07,30 U2.4 ; U4.83 21.73,51.64 v2(21.73,51.65) ; 43.06,31.68 43.07,31.69 v2(43.07,33.18)
  Bottom Layer w0.152: v2(21.73,51.65) 22.39,52.31 24.55,52.31 36.03,40.83 40.55,40.83 43.07,38.3 v2(43.07,33.18) ; v2(43.07,30) 43.07,20.79 38.14,15.86 v2(31.25,15.86)
A14: length 78.7
  Top Layer w0.152: U4.87 v2(20.33,53.07) ; J1.20 30.67,14.03 v2(31.96,15.33)
  Bottom Layer w0.152: v2(31.96,15.33) 38.21,15.33 45.07,22.18 45.07,38.95 41.51,42.5 36.99,42.5 25.26,54.24 21.5,54.24 v2(20.33,53.07)
A15: length 79
  Top Layer w0.152: J1.21 32.17,14.41 v2(32.57,14.82) ; 20.43,53.88 18.41,51.86
  Bottom Layer w0.152: v2(20.43,53.88) 21.25,54.7 25.51,54.7 37.25,42.96 41.67,42.96 45.48,39.15 45.48,21.93 38.36,14.82 v2(32.57,14.82)
BT+: length 64.7
  Top Layer w0.508: 48.75,45.93 48.75,44.3 41.97,37.53 34.5,37.53 32.46,39.57 26.07,39.57 ; BT1.1 26.05,47.79 26.07,47.77 26.07,39.57 ; 26.07,39.57 26.07,36.61 23.06,33.6 R2.1
  Top Layer w0.61: 48.75,45.93 BT1.1
CE2: length 16.2
  Top Layer w0.152: v2(6.11,27.15) 7.43,27.15 U6.6 ; v2(6.63,38.67) 8.22,40.26 8.23,40.26
  Bottom Layer w0.152: v2(6.63,38.67) 5.04,37.08 5.04,28.22 v2(6.11,27.15)
CLK: length 40.4
  Top Layer w0.152: v2(5.37,40.97) 5.4,40.97 U4.35 ; J1.2 v2(3.67,7.76)
  Bottom Layer w0.152: v2(5.37,40.97) 2.63,38.23 2.63,26.02 3.67,24.98 v2(3.67,7.76)
CS: length 38
  Top Layer w0.152: 8.92,39.54 7.57,38.2 v2(7.57,38.11) ; J1.5 8.17,11.83
  Bottom Layer w0.152: v2(8.17,11.83) 7.58,12.42 7.58,28.33 5.95,29.96 5.95,36.5 v2(7.57,38.11)
D0: length 49.5
  Top Layer w0.152: v2(15.95,35.67) 14.49,37.12 14.48,37.12 ; J1.22 33.64,3.71 33.64,7.76 35.06,9.18 35.06,20.66 31.56,24.16 U6.21 v2(21.5,24.16) U6.21
  Bottom Layer w0.152: v2(21.5,24.16) 21.5,30.11 v2(15.95,35.67)
D1: length 50.2
  Top Layer w0.152: U6.22 v2(21.96,24.66) U6.22 31.67,24.66 36.06,20.27 36.06,9.16 35.17,8.27 J1.23 ; v2(16.65,35.67) 14.85,37.47 14.83,37.47
  Bottom Layer w0.152: v2(16.65,35.67) 21.96,30.36 v2(21.96,24.66)
D2: length 50.9
  Top Layer w0.152: 15.19,37.83 17.35,35.66 v2(17.36,35.66) ; J1.24 36.67,8.7 37.06,9.1 37.06,19.88 31.78,25.16 U6.23 26.92,25.12 v2(22.46,25.12) 20.48,25.12 U6.23
  Bottom Layer w0.152: v2(22.46,25.12) 22.43,25.14 22.43,30.6 v2(17.36,35.66)
D3: length 51.3
  Top Layer w0.152: 15.54,38.18 18.05,35.67 v2(18.08,35.67) ; J1.25 38.06,3.79 38.06,19.49 31.39,26.16 U6.25 26.95,26.17 v2(22.89,26.17) 20.45,26.17 U6.25
  Bottom Layer w0.152: v2(18.08,35.67) 22.89,30.85 v2(22.89,26.17)
D4: length 52.5
  Top Layer w0.152: U6.26 v2(23.35,26.66) U6.26 31.6,26.66 39.56,18.7 39.56,3.79 J1.26 ; 15.89,38.53 18.1,36.33 v2(18.13,36.33)
  Bottom Layer w0.152: v2(18.13,36.33) 23.35,31.11 v2(23.35,26.66)
D5: length 53.6
  Top Layer w0.152: 16.25,38.89 18.1,37.04 v2(18.13,37.04) ; U6.27 v2(23.86,27.16) U6.27 31.71,27.16 40.56,18.31 40.56,9.22 41.17,8.61 J1.27
  Bottom Layer w0.152: v2(18.13,37.04) 23.86,31.31 v2(23.86,27.16)
D6: length 54.7
  Top Layer w0.152: J1.28 42.67,8.12 41.56,9.23 41.56,17.97 31.87,27.66 U6.28 v2(24.37,27.66) U6.28 ; 16.6,39.24 18.13,37.71 v2(18.13,37.7)
  Bottom Layer w0.152: v2(18.13,37.7) 24.37,31.46 v2(24.37,27.66)
D7: length 56.2
  Top Layer w0.152: J1.29 44.21,3.72 44.21,7.65 42.56,9.3 42.56,17.58 31.98,28.16 U6.29 v2(24.85,28.16) U6.29 ; v2(19.11,38.85) 17.68,40.28
  Bottom Layer w0.152: 24.85,28.85 24.85,33.11 v2(19.11,38.85) ; 24.85,28.47 24.85,28.85 ; v2(24.85,28.16) 24.85,28.47
RAM_A13: length 14.5
  Top Layer w0.152: 8.56,39.89 7.54,38.88 v2(7.54,38.83) ; U6.4 6.23,28.16 v2(5.9,28.48)
  Bottom Layer w0.152: v2(7.54,38.83) 5.5,36.79 5.5,28.89 v2(5.9,28.48)
RAM_A14: length 21.8
  Top Layer w0.152: U6.11 v2(6.38,24.66) ; U4.36 5.33,40.19 v2(5.31,40.19)
  Bottom Layer w0.152: v2(5.31,40.19) 3.11,37.99 3.11,26.45 4.9,24.66 v2(6.38,24.66)
RAM_A15: length 18.7
  Top Layer w0.152: U6.7 7.43,26.67 v2(4.88,26.67) ; U4.38 7.52,40.94 v2(6.01,39.42)
  Bottom Layer w0.152: v2(4.88,26.67) 4.77,26.67 4.02,27.42 4.02,37.44 v2(6.01,39.42)
RAM_A16: length 20.6
  Top Layer w0.152: v2(6.15,40.29) 7.17,41.3 U4.37 ; U6.10 v2(5.91,25.16)
  Bottom Layer w0.152: v2(5.91,25.16) 5.06,25.16 3.57,26.65 3.57,37.7 v2(6.15,40.29)
RAM_CS: length 59.1
  Top Layer w0.152: v2(12.91,54.19) 12.96,54.19 U4.99 ; v2(17.38,28.69) 17.41,28.66 U6.30 v2(25.3,28.66) U6.30 ; v2(15.94,30.16) 6.1,30.16 5.29,29.35 4.38,29.35 3.66,28.63 R3.1
  Bottom Layer w0.152: v2(12.91,54.19) 10.93,52.21 10.93,47.89 25.3,33.52 v2(25.3,28.66) ; v2(17.38,28.69) 15.94,30.14 v2(15.94,30.16)
RD: length 99
  Top Layer w0.152: v2(34.56,20.3) 34.56,11.92 U2.28 ; U6.32 v2(25.83,29.66) U6.32 17.65,29.66 16.83,28.84 16.83,15.94 16.22,15.33 9.51,15.33 6.67,12.48 6.67,3.69 J1.4 ; v2(14.79,53.27) 14.87,53.27 U4.95
  Bottom Layer w0.152: v2(14.79,53.27) 11.69,50.17 11.69,47.79 25.83,33.65 v2(25.83,29.66) 25.83,26.39 31.91,20.3 v2(34.56,20.3)
ROM_A14: length 37.5
  Top Layer w0.152: v2(43.56,33.74) 43.56,31.68 ; 19.82,50.45 21.8,52.42 v2(21.8,52.44)
  Bottom Layer w0.152: v2(21.8,52.44) 22.18,52.82 24.69,52.82 36.27,41.23 40.8,41.23 43.56,38.47 v2(43.56,33.74)
ROM_A15: length 38.6
  Top Layer w0.152: 44.06,31.68 v2(44.06,33.21) ; 19.47,50.8 21.05,52.38 v2(21.05,52.39)
  Bottom Layer w0.152: v2(44.06,33.21) 44.06,38.63 41.01,41.69 36.48,41.69 24.9,53.27 21.93,53.27 v2(21.05,52.39)
ROM_A16: length 39.9
  Top Layer w0.152: v2(44.56,33.72) 44.57,33.71 U2.1 ; U4.86 21.17,53.21 v2(21.17,53.21)
  Bottom Layer w0.152: v2(21.17,53.21) 21.74,53.78 25.06,53.78 36.74,42.1 41.31,42.1 44.56,38.85 v2(44.56,33.72)
ROM_A17: length 63.6
  Top Layer w0.152: v2(19.69,53.87) 19.69,53.85 U4.89 ; U2.48 44.57,14.35 v2(44.56,14.36)
  Bottom Layer w0.152: v2(44.56,14.36) 44.56,20.2 45.88,21.52 45.88,39.4 41.92,43.37 37.45,43.37 25.66,55.15 20.98,55.15 v2(19.69,53.87)
ROM_A18: length 27.7
  Top Layer w0.152: U2.17 v2(36.57,29.75) ; 21.24,43.8 20.08,44.96
  Bottom Layer w0.152: v2(20.08,44.96) 29.24,35.8 32.93,35.8 36.57,32.15 v2(36.57,29.75)
ROM_A19: length 28.6
  Top Layer w0.152: U2.16 v2(37.07,30.26) ; v2(19.93,45.86) 21.59,44.2 U4.72
  Bottom Layer w0.152: v2(37.07,30.26) 37.07,32.32 33.23,36.15 29.64,36.15 v2(19.93,45.86)
ROM_A20: length 28.1
  Top Layer w0.152: U2.9 v2(40.57,33.72) ; 22.65,47.62 22.65,47.61 v2(21.87,46.83)
  Bottom Layer w0.152: v2(21.87,46.83) 31.07,37.63 38.01,37.63 40.57,35.06 v2(40.57,33.72)
ROM_A21: length 29
  Top Layer w0.152: U4.75 22.65,45.22 v2(21.24,46.64) ; U2.10 40.07,33.18
  Bottom Layer w0.152: v2(21.24,46.64) 30.6,37.27 37.81,37.27 40.07,35.01 v2(40.07,33.18)
ROM_A22: length 27.6
  Top Layer w0.152: U2.13 38.57,33.04 38.57,33.03 v2(38.57,32.9) ; U4.73 21.94,44.51 v2(20.81,45.64)
  Bottom Layer w0.152: v2(20.81,45.64) 29.89,36.56 37.4,36.56 38.57,35.39 v2(38.57,32.9)
ROM_CS: length 46.9
  Top Layer w0.152: v2(33.57,19.65) 33.57,19.64 U2.26 ; 10.7,37.79 8.85,35.94 v2(8.85,35.29)
  Bottom Layer w0.152: v2(8.85,35.29) 8.85,32.34 16.77,24.42 16.77,21.47 17.74,20.51 20.43,20.51 21.96,22.03 28.1,22.03 30.49,19.65 v2(33.57,19.65)
RST: length 59.9
  Top Layer w0.152: J1.30 45.67,19.14 v2(39.48,25.33) ; 22.3,44.86 22.3,44.87 v2(20.62,46.55)
  Bottom Layer w0.152: v2(20.62,46.55) 30.26,36.92 37.6,36.92 39.46,35.06 39.46,25.35 v2(39.48,25.33)
TCK: length 13.1
  Top Layer w0.152: 3.43,48.18 2.14,49.46 v2(2.14,50.99)
  Bottom Layer w0.152: XP1.5 6.89,53.96 3.92,50.99 v2(2.14,50.99)
TDI: length 10.6
  Top Layer w0.152: XP1.3 4.35,56.55 2.7,54.9 2.7,49.61 U4.23
TDO: length 11.4
  Top Layer w0.152: XP1.2 3.08,56.4 1.59,54.9 1.59,49.31 U4.25
TMS: length 10.5
  Top Layer w0.152: XP1.4 5.65,57.72 5.65,56.68 3.26,54.29 3.26,49.75 U4.22
VMIX: length 10.9
  Top Layer w0.254: U6.8 4.46,26.16 C1.1 3.61,27.16 R3.2 2.14,28.78 3.01,29.65 3.55,29.65 D1.1 4.16,31.97 D2.1
WR: length 82.4
  Top Layer w0.152: v2(4.8,27.61) 7.38,27.61 U6.5 v2(9.41,27.66) ; v2(6.81,39.57) 7.86,40.62 U4.39 ; J1.3 5.17,12.81 v2(6.56,14.21) ; U2.11 39.57,28.83 38.67,27.92 33.49,27.92 32.42,28.99 30.14,28.99 28.36,30.77 v2(9.41,30.77)
  Bottom Layer w0.152: v2(6.81,39.57) 4.53,37.29 4.53,27.87 v2(4.8,27.61) 7.02,25.38 7.02,14.67 v2(6.56,14.21) ; v2(9.41,27.66) v2(9.41,30.77)
$1N4617: length 1.8
  Top Layer w0.254: D2.2 2.14,32.33 R2.2

## Copper pours and planes (outline as drawn; the poured copper is in the pictures)
GND on Top Layer: -2.28,61.55 52.64,61.55 52.64,-3.01 -2.28,-3.01
GND on Bottom Layer: -1.92,61.55 52.33,61.55 52.33,-1.95 -1.92,-1.95

Small or netless copper shapes (teardrops, artwork), in the pictures only: 414 on Top Layer, 147 on Bottom Layer

## Text on the board
Top Silkscreen Layer: NOR FLASH | CPLD | Designed by mori | v1.21 | TDO | TDI | TMS | TCK | GND | VCC | ChisFlash-MBC5
